# Altium schematic sheet main.SchDoc
size A4
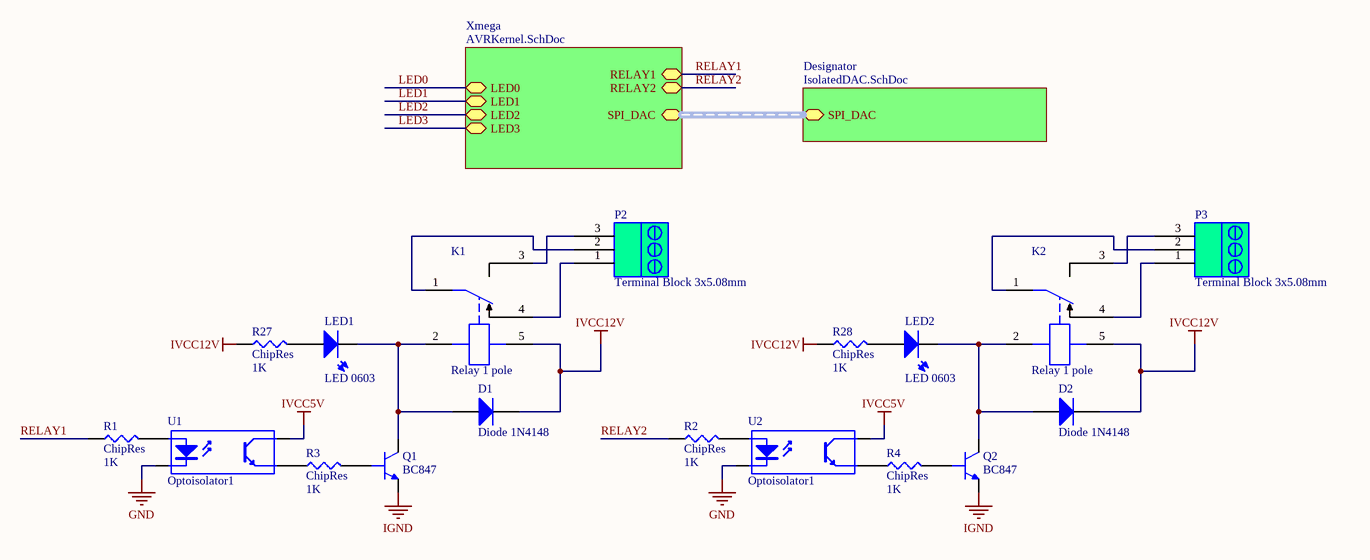
[diagram p0: main.SchDoc]

## Parts
D1  Diode 1N4148  [DO-35]
D2  Diode 1N4148  [DO-35]
K1  Relay 1 pole  [G5LA]
K2  Relay 1 pole  [G5LA]
LED1  LED 0603  [LED 0603]
LED2  LED 0603  [LED 0603]
P2  Terminal Block 3x5.08mm  [Socket 3x5.08]
P3  Terminal Block 3x5.08mm  [Socket 3x5.08]
Q1  BC847  [SOT23]
Q2  BC847  [SOT23]
R1  ChipRes  value 1K  [RES0805]
R2  ChipRes  value 1K  [RES0805]
R3  ChipRes  value 1K  [RES0805]
R4  ChipRes  value 1K  [RES0805]
R27  ChipRes  value 1K  [RES0805]
R28  ChipRes  value 1K  [RES0805]
U1  Optoisolator1  [DIP-4]
U2  Optoisolator1  [DIP-4]

## Sub-sheets
Designator = IsolatedDAC.SchDoc: SPI_DAC (harness SPI)
Xmega = AVRKernel.SchDoc: RELAY1, RELAY2, SPI_DAC (harness SPI), LED0, LED1, LED2, LED3

## Nets
GND: U1.2(K) U2.2(K)
IGND: Q1.2 Q2.2
IVCC5V: U1.4(C) U2.4(C)
IVCC12V: D1.2(K) D2.2(K) K1.5 K2.5 R27.1 R28.1
LED0: sheet Xmega/LED0
LED1: sheet Xmega/LED1
LED2: sheet Xmega/LED2
LED3: sheet Xmega/LED3
RELAY1: R1.1 ; sheet Xmega/RELAY1
RELAY2: R2.1 ; sheet Xmega/RELAY2
NetD1_1: D1.1(A) K1.2 LED1.1 Q1.3
NetD2_1: D2.1(A) K2.2 LED2.1 Q2.3
NetK1_1: K1.1 P2.2
NetK1_3: K1.3 P2.3
NetK1_4: K1.4 P2.1
NetK2_1: K2.1 P3.2
NetK2_3: K2.3 P3.3
NetK2_4: K2.4 P3.1
NetLED1_2: LED1.2 R27.2
NetLED2_2: LED2.2 R28.2
NetQ1_1: Q1.1 R3.2
NetQ2_1: Q2.1 R4.2
NetR1_2: R1.2 U1.1(A)
NetR2_2: R2.2 U2.1(A)
NetR3_1: R3.1 U1.3(E)
NetR4_1: R4.1 U2.3(E)

## Buses and harness runs
harness sheet Designator/SPI_DAC = sheet Xmega/SPI_DAC

## Library data of the parts
D1 D2 = Diode 1N4148: High Conductance Fast Diode; Published: 8-Jun-2000; LatestRevisionDate: 17-Jul-2002; LatestRevisionNote: Re-released for DXP Platform.; DatasheetVersion: 1997; PackageReference: DO-35; Publisher: Altium Limited; PackageDescription: Diode, Axial; Body 3.8 x 1.9 mm (LxDia. max), Lead Dia. 0.53 mm (max); Code_JEDEC: DO-204-AH; ComponentLink1Description: Manufacturer Link; ComponentLink1URL: http://www.fairchildsemi.com/; ComponentLink2Description: Datasheet; ComponentLink2URL: http://www.fairchildsemi.com/ds/1N%2F1N4148.pdf
K1 K2 = Relay G5LE: Relay G5LE 10A Single Pole
LED1 LED2 = LED0603
P2 P3 = Socket_3x5.08_RA_2Wall: Terminal Block Socket Right Angle 3x5.08mm 2-Wall
Q1 Q2 = BC847: NPN transistor
R1-R4 R27 R28 = ChipRes: Chip resistor
U1 U2 = Optoisolator1: 4-Pin Phototransistor Optocoupler; Published: 24-Mar-1999; LatestRevisionDate: 04-Mar-2005; LatestRevisionNote: Sch pins 3 & 4 Swapped.; DatasheetVersion: Nov-2003; PackageReference: DIP-4; Publisher: Altium Limited